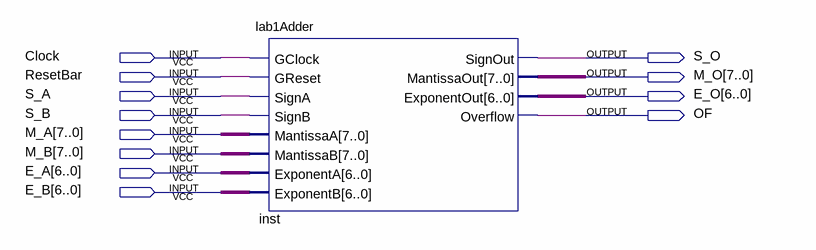
[diagram p0: schematic sheet]
// Quartus schematic lab1AdderBlock.bdf as structural Verilog: 1 symbols, 12 pins
module lab1AdderBlock (
  input  Clock,
  input  ResetBar,
  input  S_A,
  input  S_B,
  input  [7:0] M_A,
  input  [7:0] M_B,
  input  [6:0] E_A,
  input  [6:0] E_B,
  output S_O,
  output [7:0] M_O,
  output [6:0] E_O,
  output OF
);

  lab1Adder inst (
    .GClock(Clock), .GReset(ResetBar), .SignA(S_A), .SignB(S_B), .MantissaA(M_A), .MantissaB(M_B),
    .ExponentA(E_A), .ExponentB(E_B), .SignOut(S_O), .MantissaOut(M_O), .ExponentOut(E_O), .Overflow(OF));
endmodule
